# Altium schematic sheet Transceivers.SchDoc
size A3; Organization: Altium Limited; Address1: L3, 12a Rodborough Rd; Address2: Frenchs Forest; Address3: NSW; Address4: Australia 2086
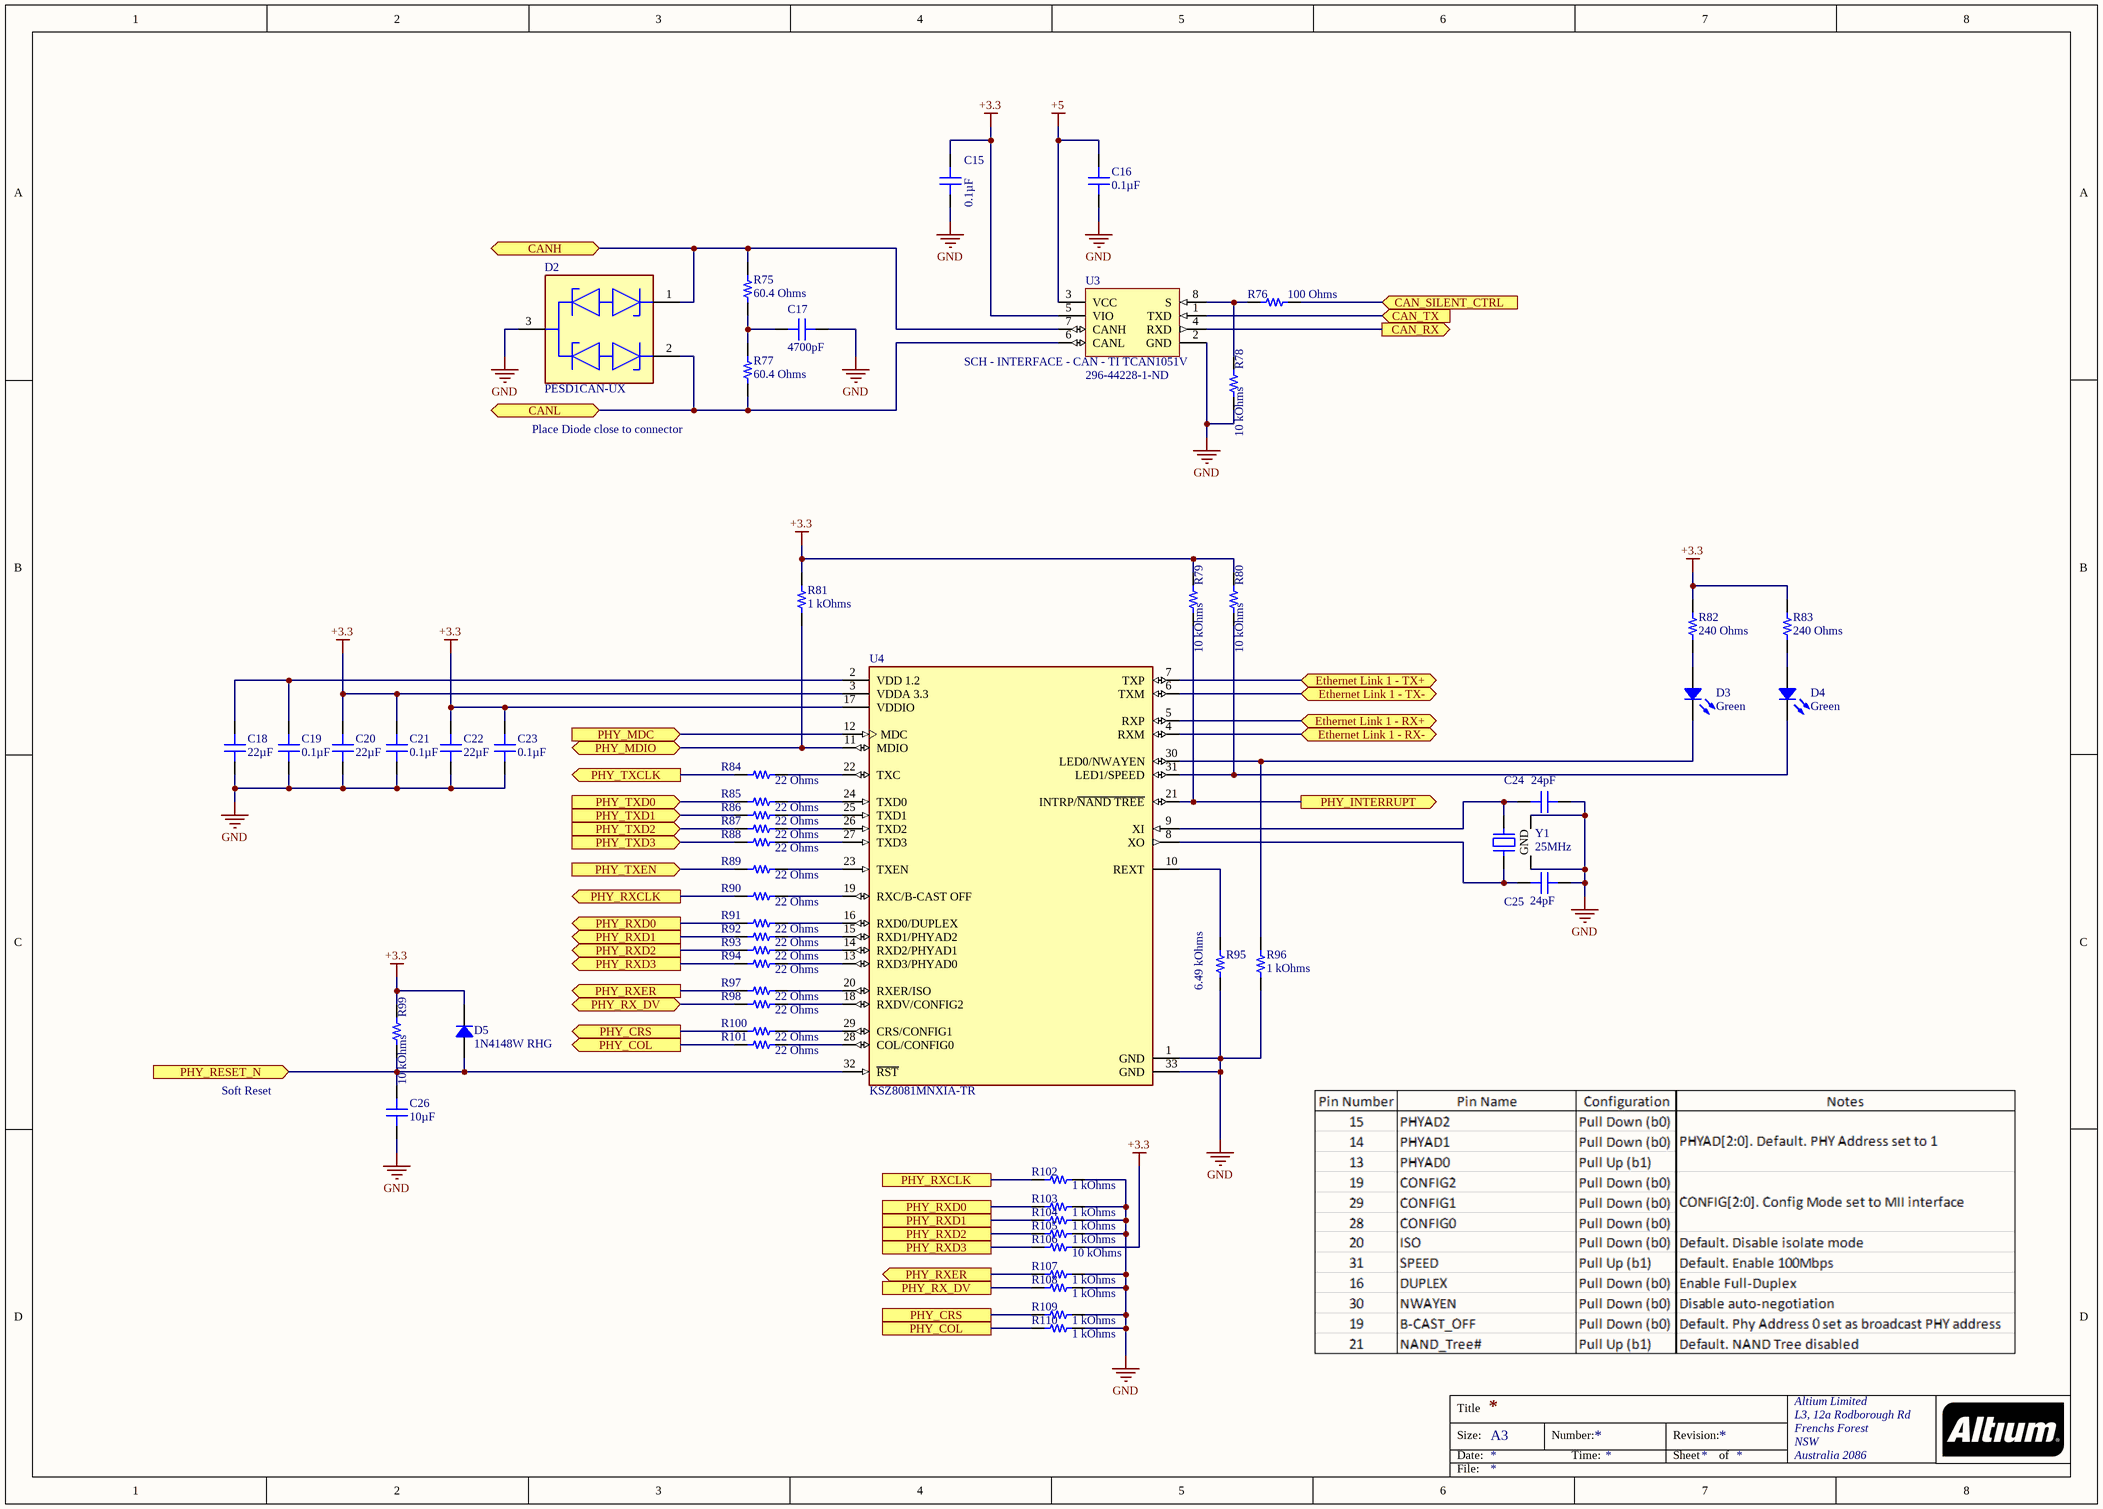
[diagram p0: Transceivers.SchDoc]

## Parts
C15  0.1µF  [CAP 0603_1608]
C16  0.1µF  [CAP 0603_1608]
C17  4700pF  [CAP 0603_1608]
C18  22µF  [CAP 0805_2012]
C19  0.1µF  [CAP 0603_1608]
C20  22µF  [CAP 0805_2012]
C21  0.1µF  [CAP 0603_1608]
C22  22µF  [CAP 0805_2012]
C23  0.1µF  [CAP 0603_1608]
C24  24pF  [CAP 0603_1608]
C25  24pF  [CAP 0603_1608]
C26  10µF  [CAP 0805_2012]
D2  PESD1CAN-UX  [FP-SOT323-MFG]
D3  Green  [LED 0603_1608 GREEN]
D4  Green  [LED 0603_1608 GREEN]
D5  1N4148W RHG  [SOD123F]
R75  60.4 Ohms  [RES 1206_3216]
R76  100 Ohms  [RES 0603_1608]
R77  60.4 Ohms  [RES 1206_3216]
R78  10 kOhms  [RES 0603_1608]
R79  10 kOhms  [RES 0603_1608]
R80  10 kOhms  [RES 0603_1608]
R81  1 kOhms  [RES 0603_1608]
R82  240 Ohms  [RES 0603_1608]
R83  240 Ohms  [RES 0603_1608]
R84  22 Ohms  [RES 0603_1608]
R85  22 Ohms  [RES 0603_1608]
R86  22 Ohms  [RES 0603_1608]
R87  22 Ohms  [RES 0603_1608]
R88  22 Ohms  [RES 0603_1608]
R89  22 Ohms  [RES 0603_1608]
R90  22 Ohms  [RES 0603_1608]
R91  22 Ohms  [RES 0603_1608]
R92  22 Ohms  [RES 0603_1608]
R93  22 Ohms  [RES 0603_1608]
R94  22 Ohms  [RES 0603_1608]
R95  6.49 kOhms  [RES 0603_1608]
R96  1 kOhms  [RES 0603_1608]
R97  22 Ohms  [RES 0603_1608]
R98  22 Ohms  [RES 0603_1608]
R99  10 kOhms  [RES 0603_1608]
R100  22 Ohms  [RES 0603_1608]
R101  22 Ohms  [RES 0603_1608]
R102  1 kOhms  [RES 0603_1608]
R103  1 kOhms  [RES 0603_1608]
R104  1 kOhms  [RES 0603_1608]
R105  1 kOhms  [RES 0603_1608]
R106  10 kOhms  [RES 0603_1608]
R107  1 kOhms  [RES 0603_1608]
R108  1 kOhms  [RES 0603_1608]
R109  1 kOhms  [RES 0603_1608]
R110  1 kOhms  [RES 0603_1608]
U3  SCH - INTERFACE - CAN - TI TCAN1051V  Supplier Part Number 1: 296-44228-1-ND  [PCB - LEADS - SOIC - TI SOIC-8]
U4  KSZ8081MNXIA-TR  [FP-QFN55-32LD-PL-5-MFG]
Y1  25MHz  [EPSON TSX-3225]

## Ports
CAN_RX (out), CAN_SILENT_CTRL (in), CAN_TX (in), CANH (bidir), CANL (bidir), Ethernet Link 1 - RX+ (bidir), Ethernet Link 1 - RX- (bidir), Ethernet Link 1 - TX+ (bidir), Ethernet Link 1 - TX- (bidir), PHY_COL, PHY_COL (out), PHY_CRS, PHY_CRS (out), PHY_INTERRUPT (out), PHY_MDC (in), PHY_MDIO (bidir), PHY_RESET_N (in), PHY_RX_DV, PHY_RX_DV (bidir), PHY_RXCLK, PHY_RXCLK (out), PHY_RXD0, PHY_RXD0 (out), PHY_RXD1, PHY_RXD1 (out), PHY_RXD2, PHY_RXD2 (out), PHY_RXD3, PHY_RXD3 (out), PHY_RXER (out), PHY_TXCLK (out), PHY_TXD0 (in), PHY_TXD1 (in), PHY_TXD2 (in), PHY_TXD3 (in), PHY_TXEN (in)

## Nets
+3.3: C15.2 C20.2 C21.2 C22.2 C23.2 D5.2 R79.2 R80.2 R81.2 R82.2 R83.2 R99.2 R106.1 U3.5(VIO) U4.3(VDDA_3.3) U4.17(VDDIO)
+5: C16.2 U3.3(VCC)
GND: C15.1 C16.1 C17.2 C18.1 C19.1 C20.1 C21.1 C22.1 C23.1 C24.2 C25.2 C26.1 D2.3(common_cathode) R78.1 R95.1 R96.1 R102.1 R103.1 R104.1 R105.1 R107.1 R108.1 R109.1 R110.1 U3.2(GND) U4.1(GND) U4.33(GND) Y1.2(GND) Y1.4(GND)
CAN_RX: U3.4(RXD) ; port CAN_RX
CAN_SILENT_CTRL: R76.2 ; port CAN_SILENT_CTRL
CAN_TX: U3.1(TXD) ; port CAN_TX
CANH: D2.1(cathode_1) R75.2 U3.7(CANH) ; port CANH
CANL: D2.2(cathode_2) R77.1 U3.6(CANL) ; port CANL
Ethernet Link 1 - RX+: U4.5(RXP) ; port Ethernet Link 1 - RX+
Ethernet Link 1 - RX-: U4.4(RXM) ; port Ethernet Link 1 - RX-
Ethernet Link 1 - TX+: U4.7(TXP) ; port Ethernet Link 1 - TX+
Ethernet Link 1 - TX-: U4.6(TXM) ; port Ethernet Link 1 - TX-
PHY_COL: R101.1 R110.2 ; port PHY_COL
PHY_CRS: R100.1 R109.2 ; port PHY_CRS
PHY_INTERRUPT: R79.1 U4.21(INTRP/~{NAND_TREE}) ; port PHY_INTERRUPT
PHY_MDC: U4.12(MDC) ; port PHY_MDC
PHY_MDIO: R81.1 U4.11(MDIO) ; port PHY_MDIO
PHY_RESET_N: C26.2 D5.1 R99.1 U4.32(~{RST}) ; port PHY_RESET_N
PHY_RX_DV: R98.1 R108.2 ; port PHY_RX_DV
PHY_RXCLK: R90.1 R102.2 ; port PHY_RXCLK
PHY_RXD0: R91.1 R103.2 ; port PHY_RXD0
PHY_RXD1: R92.1 R104.2 ; port PHY_RXD1
PHY_RXD2: R93.1 R105.2 ; port PHY_RXD2
PHY_RXD3: R94.1 R106.2 ; port PHY_RXD3
PHY_RXER: R97.1 R107.2 ; port PHY_RXER
PHY_TXCLK: R84.1 ; port PHY_TXCLK
PHY_TXD0: R85.1 ; port PHY_TXD0
PHY_TXD1: R86.1 ; port PHY_TXD1
PHY_TXD2: R87.1 ; port PHY_TXD2
PHY_TXD3: R88.1 ; port PHY_TXD3
PHY_TXEN: R89.1 ; port PHY_TXEN
NetC17_1: C17.1 R75.1 R77.2
NetC18_2: C18.2 C19.2 U4.2(VDD_1.2)
NetC24_1: C24.1 U4.9(XI) Y1.3
NetC25_1: C25.1 U4.8(XO) Y1.1
NetD3_1: D3.1 R82.1
NetD3_2: D3.2 R96.2 U4.30(LED0/NWAYEN)
NetD4_1: D4.1 R83.1
NetD4_2: D4.2 R80.1 U4.31(LED1/SPEED)
NetR76_1: R76.1 R78.2 U3.8(S)
NetR84_2: R84.2 U4.22(TXC)
NetR85_2: R85.2 U4.24(TXD0)
NetR86_2: R86.2 U4.25(TXD1)
NetR87_2: R87.2 U4.26(TXD2)
NetR88_2: R88.2 U4.27(TXD3)
NetR89_2: R89.2 U4.23(TXEN)
NetR90_2: R90.2 U4.19(RXC/B-CAST_OFF)
NetR91_2: R91.2 U4.16(RXD0/DUPLEX)
NetR92_2: R92.2 U4.15(RXD1/PHYAD2)
NetR93_2: R93.2 U4.14(RXD2/PHYAD1)
NetR94_2: R94.2 U4.13(RXD3/PHYAD0)
NetR95_2: R95.2 U4.10(REXT)
NetR97_2: R97.2 U4.20(RXER/ISO)
NetR98_2: R98.2 U4.18(RXDV/CONFIG2)
NetR100_2: R100.2 U4.29(CRS/CONFIG1)
NetR101_2: R101.2 U4.28(COL/CONFIG0)

## Notes on the sheet
- Place Diode close to connector
- Soft Reset
- Title
- Size:
- Date:
- A3
- Number:
- Time:
- Revision:
- Sheet
- of
- File:

## Library data of the parts
C15 C16 C19 C21 C23 = CL10B104KA8WPNC: CAP CER 0.1UF 25V X7R 0603; Manufacturer: Samsung Electro-Mechanics; Tolerance: ±10%; Part Number: CL10B104KA8WPNC; Value: 0.1µF; Applications: Automotive; Capacitance: 0.1µF; ComponentLink1Description: Datasheet; ComponentLink1URL: http://www.samsungsem.com/kr/support/product-search/mlcc/CL10B104KA8WPNC.jsp; ComponentLink2Description: DigiKey Link; ComponentLink2URL: http://digikey.com/product-detail/en/samsung-electro-mechanics/CL10B104KA8WPNC/1276-6717-1-ND/5961576; Device Package: 0603 (1608 Metric); Features: Open Mode; LastUpdated: 9/2/2020 1:03:30 AM; Lifecycle Status: Active; Minimum Order: 1; Mounting Type: Surface Mount, MLCC; Operating Temperature: -55°C ~ 125°C; Package / Case: 0603 (1608 Metric); Packaging: TapeAndReel; PartId: 5631; Part Status: Active; Price: 0.02; Ratings: AEC-Q200; Series: CL; Size / Dimension: 0.063" L x 0.031" W (1.60mm x 0.80mm); Supplier 1: DigiKey; Supplier Part Number 1: 1276-6717-1-ND; Temperature Coefficient: X7R; Thickness (Max): 0.035" (0.90mm); Voltage - Rated: 25V
C17 = VJ0603Y472KXACW1BC: CAP CER 4700PF 50V X7R 0603; Manufacturer: Vishay Vitramon; Tolerance: ±10%; Part Number: VJ0603Y472KXACW1BC; Value: 4700pF; Applications: General Purpose; Capacitance: 4700pF; ComponentLink1Description: Datasheet; ComponentLink1URL: https://www.vishay.com/docs/28548/vjw1bcbascomseries.pdf; ComponentLink2Description: DigiKey Link; ComponentLink2URL: http://digikey.com/product-detail/en/vishay-vitramon/VJ0603Y472KXACW1BC/720-1530-1-ND/421007; Device Package: 0603 (1608 Metric); LastUpdated: 9/2/2020 1:03:13 AM; Lifecycle Status: Active; Minimum Order: 1; Mounting Type: Surface Mount, MLCC; Operating Temperature: -55°C ~ 125°C; Package / Case: 0603 (1608 Metric); Packaging: TapeAndReel; PartId: 14247; Part Status: Active; Price: 0.01; Series: VJ; Size / Dimension: 0.063" L x 0.031" W (1.60mm x 0.80mm); Supplier 1: DigiKey; Supplier Part Number 1: 720-1530-1-ND; Temperature Coefficient: X7R; Thickness (Max): 0.035" (0.90mm); Voltage - Rated: 50V
C18 C20 C22 = CL21A226KPCLRNC: CAP CER 22UF 10V X5R 0805; Manufacturer: Samsung Electro-Mechanics; Tolerance: ±10%; Part Number: CL21A226KPCLRNC; Value: 22µF; Applications: General Purpose; Capacitance: 22µF; ComponentLink1Description: Datasheet; ComponentLink1URL: http://www.samsungsem.com/kr/support/product-search/mlcc/CL21A226KPCLRNC.jsp; ComponentLink2Description: DigiKey Link; ComponentLink2URL: http://digikey.com/product-detail/en/samsung-electro-mechanics/CL21A226KPCLRNC/1276-6786-1-ND/5961645; Device Package: 0805 (2012 Metric); Features: Low Profile; LastUpdated: 9/2/2020 1:04:38 AM; Lifecycle Status: Active; Minimum Order: 1; Mounting Type: Surface Mount, MLCC; Operating Temperature: -55°C ~ 85°C; Package / Case: 0805 (2012 Metric); Packaging: TapeAndReel; PartId: 4833; Part Status: Active; Price: 0.08; Series: CL; Size / Dimension: 0.079" L x 0.049" W (2.00mm x 1.25mm); Supplier 1: DigiKey; Supplier Part Number 1: 1276-6786-1-ND; Temperature Coefficient: X5R; Thickness (Max): 0.037" (0.95mm); Voltage - Rated: 10V
C24 C25 = CL10C240JB8NNNC: CAP CER 24PF 50V C0G/NP0 0603; Manufacturer: Samsung Electro-Mechanics; Temperature Coefficient: C0G, NP0; Tolerance: ±5%; Part Number: CL10C240JB8NNNC; Value: 24pF; Applications: General Purpose; Capacitance: 24pF; ComponentLink1Description: Datasheet; ComponentLink1URL: http://www.samsungsem.com/kr/support/product-search/mlcc/CL10C240JB8NNNC.jsp; ComponentLink2Description: DigiKey Link; ComponentLink2URL: http://digikey.com/product-detail/en/samsung-electro-mechanics/CL10C240JB8NNNC/1276-1761-1-ND/3889847; Device Package: 0603 (1608 Metric); LastUpdated: 9/2/2020 1:03:22 AM; Lifecycle Status: Active; Minimum Order: 1; Mounting Type: Surface Mount, MLCC; Operating Temperature: -55°C ~ 125°C; Package / Case: 0603 (1608 Metric); Packaging: TapeAndReel; PartId: 10003; Part Status: Active; Price: 0.01; Series: CL; Size / Dimension: 0.063" L x 0.031" W (1.60mm x 0.80mm); Supplier 1: DigiKey; Supplier Part Number 1: 1276-1761-1-ND; Thickness (Max): 0.035" (0.90mm); Voltage - Rated: 50V
C26 = CC0805KKX5R7BB106: CAP CER 10UF 16V X5R 0805; Manufacturer: Yageo; Tolerance: ±10%; Part Number: CC0805KKX5R7BB106; Value: 10µF; Applications: General Purpose; Capacitance: 10µF; ComponentLink1Description: Datasheet; ComponentLink1URL: https://www.yageo.com/upload/media/product/productsearch/datasheet/mlcc/UPY-GPHC_X5R_4V-to-50V_25.pdf; ComponentLink2Description: DigiKey Link; ComponentLink2URL: http://digikey.com/product-detail/en/yageo/CC0805KKX5R7BB106/311-1865-1-ND/5195767; Device Package: 0805 (2012 Metric); LastUpdated: 9/2/2020 1:04:30 AM; Lifecycle Status: Active; Minimum Order: 1; Mounting Type: Surface Mount, MLCC; Operating Temperature: -55°C ~ 85°C; Package / Case: 0805 (2012 Metric); Packaging: TapeAndReel; PartId: 8867; Part Status: Active; Price: 0.09; Series: CC; Size / Dimension: 0.079" L x 0.049" W (2.00mm x 1.25mm); Supplier 1: DigiKey; Supplier Part Number 1: 311-1865-1-ND; Temperature Coefficient: X5R; Thickness (Max): 0.057" (1.45mm); Voltage - Rated: 16V
D2 = CMP-14436-000006-1: TVS DIODE 24V 50V SC70-3
D3 D4 = LTST-C193KGKT-5A: LED GREEN CLEAR CHIP SMD; Manufacturer: Lite-On Inc.; Configuration: Standard; Current - Test: 5mA; Lens Color: Colorless; Lens Size: 1.15mm x 0.80mm; Lens Style: Rectangle with Flat Top; Millicandela Rating: 16.25mcd; Viewing Angle: 130°; Voltage - Forward (Vf) (Typ): 2V; Wavelength - Dominant: 572nm; Wavelength - Peak: 574nm; Part Number: LTST-C193KGKT-5A; Color: Green; ComponentLink1Description: Datasheet; ComponentLink1URL: http://optoelectronics.liteon.com/upload/download/DS22-2007-0094/LTST-C193KGKT-5A.PDF; ComponentLink2Description: DigiKey Link; ComponentLink2URL: http://digikey.com/product-detail/en/lite-on-inc/LTST-C193KGKT-5A/160-1828-1-ND/2356247; Device Package: 0603 (1608 Metric); Height (Max): 0.45mm; LastUpdated: 9/2/2020 1:20:41 AM; Lens Transparency: Clear; Lifecycle Status: Active; Minimum Order: 1; Mounting Type: Surface Mount; Package / Case: 0603 (1608 Metric); Packaging: TapeAndReel; PartId: 694; Part Status: Active; Price: 0.06; Series: -; Size / Dimension: 1.60mm L x 0.80mm W; Supplier 1: DigiKey; Supplier Part Number 1: 160-1828-1-ND; Supplier Device Package: Chip LED; Value: Green
D5 = 1N4148W RHG: DIODE GEN PURP 100V 150MA SOD123; Manufacturer: Taiwan Semiconductor Corporation; Current - Average Rectified (Io): 150mA (DC); Current - Reverse Leakage @ Vr: 5µA @ 75V; Diode Type: Standard; Reverse Recovery Time (trr): 4ns; Speed: Fast Recovery =< 500ns, > 200mA (Io); Voltage - Forward (Vf) (Max) @ If: 1V @ 100mA; Part Number: 1N4148W RHG; ComponentLink1Description: Datasheet; ComponentLink1URL: https://www.taiwansemi.com/products/datasheet/1N4148W%20SERIES_K1804.pdf; ComponentLink2Description: DigiKey Link; ComponentLink2URL: http://digikey.com/product-detail/en/taiwan-semiconductor-corporation/1N4148W-RHG/1N4148WRHGCT-ND/7357066; LastUpdated: 9/2/2020 1:19:10 AM; Lifecycle Status: Active; Minimum Order: 1; Mounting Type: Surface Mount; Operating Temperature - Junction: -65°C ~ 150°C; Package / Case: SOD-123F; Packaging: TapeAndReel; PartId: 1073; Part Status: Active; Price: 0.03; Series: -; Supplier 1: DigiKey; Supplier Part Number 1: 1N4148WRHGCT-ND; Supplier Device Package: SOD-123F; Voltage - DC Reverse (Vr) (Max): 100V
R75 R77 = ESR18EZPF60R4: RES SMD 60.4 OHM 1% 1/2W 1206; Manufacturer: Rohm Semiconductor; Power (Watts): 0.5W, 1/2W; Temperature Coefficient: ±100ppm/°C; Part Number: ESR18EZPF60R4; ComponentLink1Description: Datasheet; ComponentLink1URL: https://www.rohm.com/datasheet/ESR01MZPF/esr-e; ComponentLink2Description: DigiKey Link; ComponentLink2URL: http://digikey.com/product-detail/en/rohm-semiconductor/ESR18EZPF60R4/RHM60.4AFCT-ND/1983938; Composition: Thick Film; Device Package: 1206 (3216 Metric); Features: Automotive AEC-Q200, Pulse Withstanding; Height - Seated (Max): 0.026" (0.65mm); LastUpdated: 9/2/2020 1:12:41 AM; Lifecycle Status: Active; Minimum Order: 1; Number of Terminations: 2; Operating Temperature: -55°C ~ 155°C; Package / Case: 1206 (3216 Metric); Packaging: TapeAndReel; PartId: 38901; Part Status: Active; Price: 0.02; Ratings: AEC-Q200; Resistance: 60.4 Ohms; Series: ESR; Size / Dimension: 0.126" L x 0.063" W (3.20mm x 1.60mm); Supplier 1: DigiKey; Supplier Part Number 1: RHM60.4AFCT-ND; Supplier Device Package: 1206; Tolerance: ±1%; Value: 60.4 Ohms
R76 = RMCF0603FG100R: RES 100 OHM 1% 1/10W 0603; Manufacturer: Stackpole Electronics Inc; Power (Watts): 0.1W, 1/10W; Temperature Coefficient: ±100ppm/°C; Part Number: RMCF0603FG100R; Value: 100 Ohms; ComponentLink1Description: Datasheet; ComponentLink1URL: https://www.seielect.com/catalog/sei-rmcf_rmcp.pdf; ComponentLink2Description: DigiKey Link; ComponentLink2URL: http://digikey.com/product-detail/en/stackpole-electronics-inc/RMCF0603FG100R/RMCF0603FG100RCT-ND/4425033; Composition: Thick Film; Device Package: 0603 (1608 Metric); Features: Automotive AEC-Q200; Height - Seated (Max): 0.022" (0.55mm); LastUpdated: 9/2/2020 1:09:39 AM; Lifecycle Status: Active; Minimum Order: 1; Number of Terminations: 2; Operating Temperature: -55°C ~ 155°C; Package / Case: 0603 (1608 Metric); Packaging: CutTape; PartId: 24036; Part Status: Active; Price: 0.10; Ratings: AEC-Q200; Resistance: 100 Ohms; Series: RMCF; Size / Dimension: 0.061" L x 0.031" W (1.55mm x 0.80mm); Supplier 1: DigiKey; Supplier Part Number 1: RMCF0603FG100RCT-ND; Supplier Device Package: 0603; Tolerance: ±1%
R78-R80 R99 R106 = RMCF0603JT10K0: RES 10K OHM 5% 1/10W 0603; Manufacturer: Stackpole Electronics Inc; Power (Watts): 0.1W, 1/10W; Temperature Coefficient: ±200ppm/°C; Part Number: RMCF0603JT10K0; Value: 10 kOhms; ComponentLink1Description: Datasheet; ComponentLink1URL: https://www.seielect.com/catalog/sei-packaging.pdf; ComponentLink2Description: DigiKey Link; ComponentLink2URL: http://digikey.com/product-detail/en/stackpole-electronics-inc/RMCF0603JT10K0/RMCF0603JT10K0CT-ND/1943191; Composition: Thick Film; Device Package: 0603 (1608 Metric); Features: Automotive AEC-Q200; Height - Seated (Max): 0.022" (0.55mm); LastUpdated: 8/30/2020 8:48:45 PM; Lifecycle Status: Active; Minimum Order: 1; Number of Terminations: 2; Operating Temperature: -55°C ~ 155°C; Package / Case: 0603 (1608 Metric); Packaging: CutTape; PartId: 25659; Part Status: Active; Price: 0.10; Ratings: AEC-Q200; Resistance: 10 kOhms; Series: RMCF; Size / Dimension: 0.061" L x 0.031" W (1.55mm x 0.80mm); Supplier 1: DigiKey; Supplier Part Number 1: RMCF0603JT10K0CT-ND; Supplier Device Package: 0603; Tolerance: ±5%
R81 R96 R102-R105 R107-R110 = RNCP0603FTD1K00: RES 1K OHM 1% 1/8W 0603; Manufacturer: Stackpole Electronics Inc; Power (Watts): 0.125W, 1/8W; Temperature Coefficient: ±100ppm/°C; Part Number: RNCP0603FTD1K00; Value: 1 kOhms; ComponentLink1Description: Datasheet; ComponentLink1URL: https://www.seielect.com/catalog/sei-rncp.pdf; ComponentLink2Description: DigiKey Link; ComponentLink2URL: http://digikey.com/product-detail/en/stackpole-electronics-inc/RNCP0603FTD1K00/RNCP0603FTD1K00CT-ND/2240445; Composition: Thin Film; Device Package: 0603 (1608 Metric); Features: Anti-Sulfur, Moisture Resistant; Height - Seated (Max): 0.020" (0.50mm); LastUpdated: 9/2/2020 1:10:23 AM; Lifecycle Status: Active; Minimum Order: 1; Number of Terminations: 2; Operating Temperature: -55°C ~ 155°C; Package / Case: 0603 (1608 Metric); Packaging: TapeAndReel; PartId: 5694; Part Status: Active; Price: 0.01; Resistance: 1 kOhms; Series: RNCP; Size / Dimension: 0.059" L x 0.031" W (1.50mm x 0.80mm); Supplier 1: DigiKey; Supplier Part Number 1: RNCP0603FTD1K00CT-ND; Supplier Device Package: 0603; Tolerance: ±1%
R82 R83 = RMCF0603JT240R: RES 240 OHM 5% 1/10W 0603; Manufacturer: Stackpole Electronics Inc; Power (Watts): 0.1W, 1/10W; Temperature Coefficient: ±200ppm/°C; Part Number: RMCF0603JT240R; Value: 240 Ohms; ComponentLink1Description: Datasheet; ComponentLink1URL: https://www.seielect.com/catalog/sei-rmcf_rmcp.pdf; ComponentLink2Description: DigiKey Link; ComponentLink2URL: http://digikey.com/product-detail/en/stackpole-electronics-inc/RMCF0603JT240R/RMCF0603JT240RCT-ND/2418189; Composition: Thick Film; Device Package: 0603 (1608 Metric); Features: Automotive AEC-Q200; Height - Seated (Max): 0.022" (0.55mm); LastUpdated: 9/2/2020 1:10:22 AM; Lifecycle Status: Active; Minimum Order: 1; Number of Terminations: 2; Operating Temperature: -55°C ~ 155°C; Package / Case: 0603 (1608 Metric); Packaging: CutTape; PartId: 5995; Part Status: Active; Price: 0.10; Ratings: AEC-Q200; Resistance: 240 Ohms; Series: RMCF; Size / Dimension: 0.061" L x 0.031" W (1.55mm x 0.80mm); Supplier 1: DigiKey; Supplier Part Number 1: RMCF0603JT240RCT-ND; Supplier Device Package: 0603; Tolerance: ±5%
R84-R94 R97 R98 R100 R101 = RMCF0603FT22R0: RES 22 OHM 1% 1/10W 0603; Manufacturer: Stackpole Electronics Inc; Power (Watts): 0.1W, 1/10W; Temperature Coefficient: ±100ppm/°C; Part Number: RMCF0603FT22R0; Value: 22 Ohms; ComponentLink1Description: Datasheet; ComponentLink1URL: https://www.seielect.com/catalog/sei-packaging.pdf; ComponentLink2Description: DigiKey Link; ComponentLink2URL: http://digikey.com/product-detail/en/stackpole-electronics-inc/RMCF0603FT22R0/RMCF0603FT22R0CT-ND/1942946; Composition: Thick Film; Device Package: 0603 (1608 Metric); Features: Automotive AEC-Q200; Height - Seated (Max): 0.022" (0.55mm); LastUpdated: 9/2/2020 1:10:13 AM; Lifecycle Status: Active; Minimum Order: 1; Number of Terminations: 2; Operating Temperature: -55°C ~ 155°C; Package / Case: 0603 (1608 Metric); Packaging: CutTape; PartId: 10611; Part Status: Active; Price: 0.10; Ratings: AEC-Q200; Resistance: 22 Ohms; Series: RMCF; Size / Dimension: 0.061" L x 0.031" W (1.55mm x 0.80mm); Supplier 1: DigiKey; Supplier Part Number 1: RMCF0603FT22R0CT-ND; Supplier Device Package: 0603; Tolerance: ±1%
R95 = RNCP0603FTD6K49: RES 6.49K OHM 1% 1/8W 0603; Manufacturer: Stackpole Electronics Inc; Power (Watts): 0.125W, 1/8W; Temperature Coefficient: ±100ppm/°C; Part Number: RNCP0603FTD6K49; Value: 6.49 kOhms; ComponentLink1Description: Datasheet; ComponentLink1URL: https://www.seielect.com/catalog/sei-rncp.pdf; ComponentLink2Description: DigiKey Link; ComponentLink2URL: http://digikey.com/product-detail/en/stackpole-electronics-inc/RNCP0603FTD6K49/RNCP0603FTD6K49CT-ND/2240472; Composition: Thin Film; Device Package: 0603 (1608 Metric); Features: Anti-Sulfur, Moisture Resistant; Height - Seated (Max): 0.020" (0.50mm); LastUpdated: 9/2/2020 1:09:47 AM; Lifecycle Status: Active; Minimum Order: 1; Number of Terminations: 2; Operating Temperature: -55°C ~ 155°C; Package / Case: 0603 (1608 Metric); Packaging: TapeAndReel; PartId: 22308; Part Status: Active; Price: 0.01; Resistance: 6.49 kOhms; Series: RNCP; Size / Dimension: 0.059" L x 0.031" W (1.50mm x 0.80mm); Supplier 1: DigiKey; Supplier Part Number 1: RNCP0603FTD6K49CT-ND; Supplier Device Package: 0603; Tolerance: ±1%
U4 = CMP-06281-000005-1: IC TRANSCEIVER FULL 1/1 32QFN; Manufacturer: Microchip; Max Junction Temp: +125°C; Max Supply Voltage: 3.465V; Min Supply Voltage: 1.71V; Data Rate: 100Mbits/s; Simplex Duplex: Full Duplex; Standoff Height: 0mm; Number Of Channels: 1; Interface: Ethernet,Other; Device Class L2: Interface ICs; Package: QFN55-32LD-PL-5; Octopart: https://octopart.com/ksz8081mnxia-tr-microchip-66799958; Ambient Temperature Range High: +85°C; Device Class L3: Ethernet Interface ICs; Mouser Description: Ethernet ICs 10/100 PHY,  0.11u, I-Temp; Temperature: -40°C to +85°C; Category: IC; Lead Free: Yes; Ambient Temperature Range Low: -40°C; Height: 1mm; ComponentLink2URL: http://ww1.microchip.com/downloads/en/DeviceDoc/00002202C.pdf; Digikey Description: IC TRANSCEIVER FULL 1/1 32QFN; Automotive: No; Device Class L1: Integrated Circuits (ICs); ComponentLink2Description: Datasheet; Temperature Range High: +85°C; Temperature Range Low: -40°C; RoHS: TRUE; Manufacturer Part Number: KSZ8081MNXIA-TR
Y1 = TSX-3225 25.0000MF20P-C0: CRYSTAL 25.0000MHZ 18PF SMD; Manufacturer: EPSON; ESR (Equivalent Series Resistance): 40 Ohms; Frequency Stability: ±20ppm; Frequency Tolerance: ±10ppm; Operating Mode: Fundamental; Part Number: TSX-3225 25.0000MF20P-C0; ComponentLink1Description: Datasheet; ComponentLink1URL: https://support.epson.biz/td/api/doc_check.php?dl=brief_TSX-3225&lang=en; ComponentLink2Description: DigiKey Link; ComponentLink2URL: http://digikey.com/product-detail/en/epson/TSX-3225-25.0000MF20P-C0/SER4212CT-ND/7430967; Frequency: 25MHz; Height - Seated (Max): 0.024" (0.60mm); LastUpdated: 9/2/2020 1:21:54 AM; Lifecycle Status: Active; Load Capacitance: 18pF; Minimum Order: 1; Mounting Type: Surface Mount; Operating Temperature: -20°C ~ 85°C; Package / Case: 4-SMD, No Lead; Packaging: TapeAndReel; PartId: 447; Part Status: Active; Price: 0.18; Series: TSX-3225; Size / Dimension: 0.126" L x 0.098" W (3.20mm x 2.50mm); Supplier 1: DigiKey; Supplier Part Number 1: SER4212CT-ND; Type: MHz Crystal; Value: 25MHz
U3 = SCH - INTERFACE - CAN - TI TCAN1051V: Supplier 1: Digi-Key